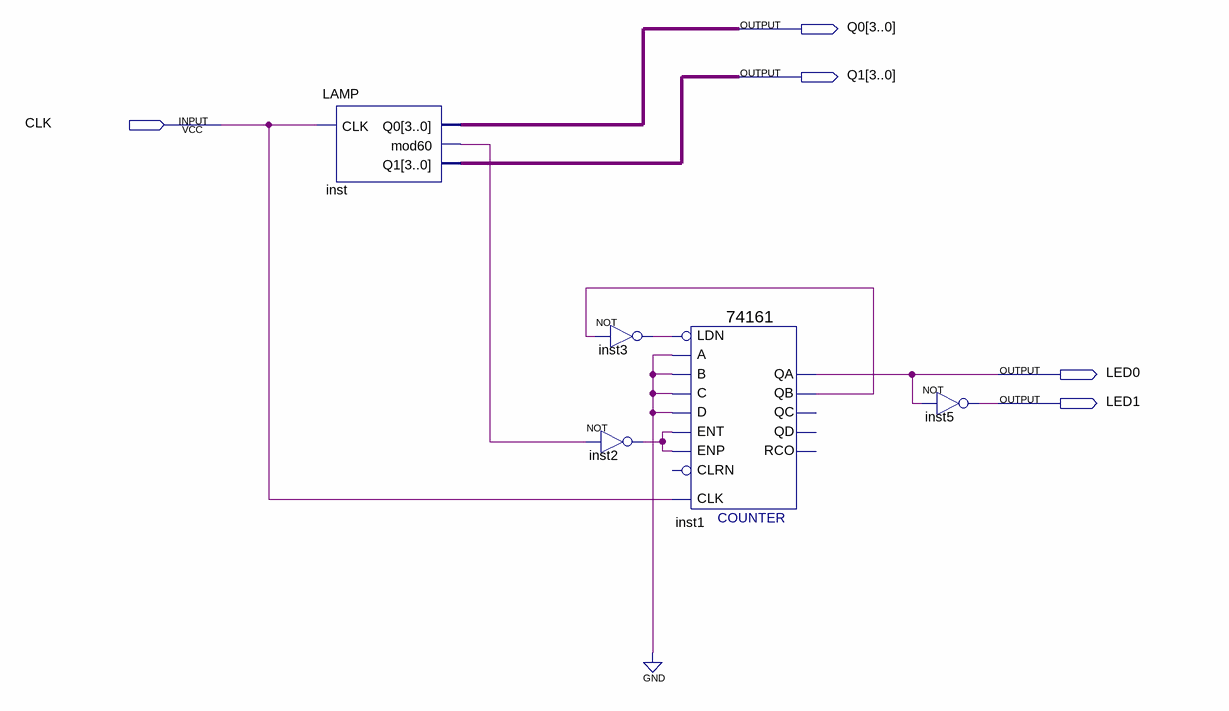
[diagram p0: schematic sheet]
// Quartus schematic SIGNAL_LAMP.bdf as structural Verilog: 5 symbols, 5 pins
module SIGNAL_LAMP (
  input  CLK,
  output [3:0] Q0,
  output [3:0] Q1,
  output LED0,
  output LED1
);

  wire inst1_qb, inst2_out, inst3_out, inst_mod60;

  LAMP inst (.CLK(CLK), .Q0(Q0), .mod60(inst_mod60), .Q1(Q1));
  not inst3 (inst3_out, inst1_qb);
  not inst2 (inst2_out, inst_mod60);
  \74161  inst1 (
    .CLK(CLK), .ENP(inst2_out), .LDN(inst3_out), .A(1'b0), .D(1'b0), .ENT(inst2_out), .B(1'b0), .C(1'b0),
    .QB(inst1_qb), .QA(LED0));  // open: CLRN, QD, QC, RCO
  not inst5 (LED1, LED0);
endmodule
